# Altium schematic sheet SensorExt.SchDoc
size A4
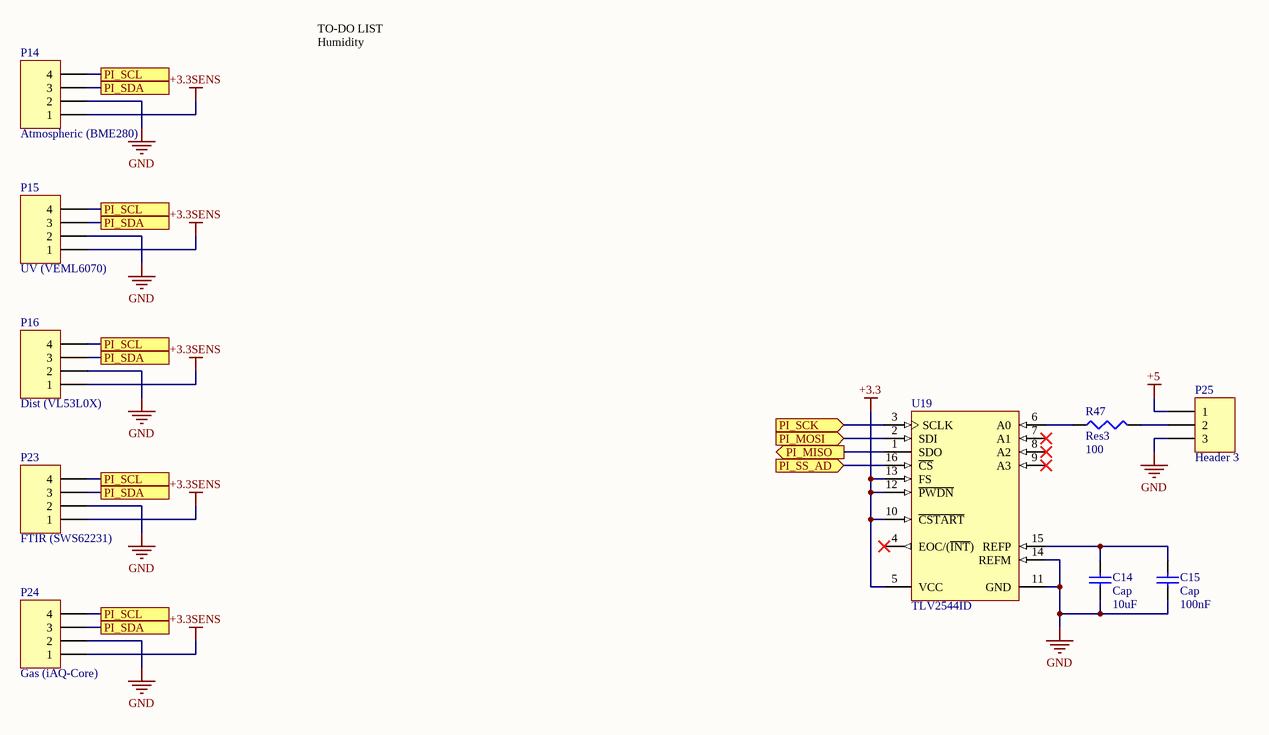
[diagram p0: SensorExt.SchDoc]

## Parts
C14  Cap  value 10uF  [C0805]
C15  Cap  value 100nF  [C0805]
P14  Atmospheric (BME280)  [22-23-20x1-4pos]
P15  UV (VEML6070)  [22-23-20x1-4pos]
P16  Dist (VL53L0X)  [22-23-20x1-4pos]
P23  FTIR (SWS62231)  [22-23-20x1-4pos]
P24  Gas (iAQ-Core)  [22-23-20x1-4pos]
P25  Header 3  [22-23-20x1-3pos]
R47  Res3  value 100  [C0805]
U19  TLV2544ID  [TI-D16_M]

## Ports
PI_MISO (out), PI_MOSI (in), PI_SCK (in), PI_SCL, PI_SDA, PI_SS_AD (in)

## Nets
+3.3: U19.5(VCC) U19.10(~{CSTART}) U19.12(~{PWDN}) U19.13(FS)
+3.3SENS: P14.1 P15.1 P16.1 P23.1 P24.1
+5: P25.1
GND: C14.1 C15.1 P14.2 P15.2 P16.2 P23.2 P24.2 P25.3 U19.11(GND) U19.14(REFM)
PI_MISO: U19.1(SDO) ; port PI_MISO
PI_MOSI: U19.2(SDI) ; port PI_MOSI
PI_SCK: U19.3(SCLK) ; port PI_SCK
PI_SCL: P14.4 P15.4 P16.4 P23.4 P24.4 ; port PI_SCL
PI_SDA: P14.3 P15.3 P16.3 P23.3 P24.3 ; port PI_SDA
PI_SS_AD: U19.16(~{CS}) ; port PI_SS_AD
NetC14_2: C14.2 C15.2 U19.15(REFP)
NetP25_2: P25.2 R47.2
NetR47_1: R47.1 U19.6(A0)

Not connected (* = marked no-connect by the designer): U19 4(EOC/(~{INT}))* 7(A1)* 8(A2)* 9(A3)*

## Notes on the sheet
- TO-DO LIST
  Humidity

## Library data of the parts
C14 C15 = Cap: Capacitor; Published: 8-Jun-2000; LatestRevisionDate: 17-Jul-2002; LatestRevisionNote: Re-released for DXP Platform.; PackageReference: RAD-0.3; Publisher: Altium Limited; PackageDescription: Radial Cap, Thru-Hole; 2 Leads; 0.3 in Pin Spacing
P14-P16 P23 P24 = Header 4: Header, 4-Pin; LatestRevisionDate: 17-Jul-2002; LatestRevisionNote: Re-released for DXP Platform.; Publisher: Altium Limited
P25 = Header 3: Header, 3-Pin; LatestRevisionDate: 17-Jul-2002; LatestRevisionNote: Re-released for DXP Platform.; Publisher: Altium Limited
R47 = Res3: Resistor; Published: 8-Jun-2000; LatestRevisionDate: 29-May-2009; LatestRevisionNote: IPC-7351 Footprint Added.; PackageReference: J1-0603; Publisher: Altium Limited; PackageDescription: Chip Resistor
U19 = CMP-0003-01025-2: 12-Bit 200 kSPS ADC Serial Out, Auto Power Down (Software and Hardware), Low Power with 8 x FIFO with 4 Channel, -40 to 85 degC, 16-pin SOIC (D16), Green (RoHS & no Sb/Br); Manufacturer: Texas Instruments; SFDR(dB): 84; Architecture: SAR; Digital Supply(Min)(V): 2.7; Interface: Serial SPI; ENOB(Bits): 11.6; # Input Channels: 4; Sample Rate (max)(SPS): 200k; Analog Voltage AV/DD(Max)(V): 5.5; SubFamily: Precision ADC (<=10MSPS); INL(Max)(+/-LSB): 1; SINAD(dB): 70; Resolution(Bits): 12; DatasheetVersion: SLAS198E; Analog Voltage AV/DD(Min)(V): 2.7; PackageDescription: 16-Pin Plastic Small Outline, Body 9.9 x 3.9 mm, Pitch 1.27 mm; PackageVersion: 4040047-6/M, 06/2011; PartNumber: TLV2544ID; Eco-Plan: Green (RoHS & no Sb/Br); ComponentLink2Description: Datasheet; PackageReference: D16; ComponentLink3Description: Package Specification; Code_JEDEC: MS-012; ComponentLink3URL: http://www.ti.com/litv/pdf/mpds178g; Digital Supply(Max)(V): 5.5; ComponentLink1Description: Manufacturer URL; Mounting Technology: Surface Mount; ComponentLink2URL: http://www.ti.com/general/docs/lit/getliterature.tsp?genericPartNumber=TLV2544&fileType=pdf; ComponentLink1URL: http://www.ti.com/